# Altium schematic sheet Analog_Inputs_10V.SchDoc
size A4; SheetNumber: 6; SheetTotal: 13
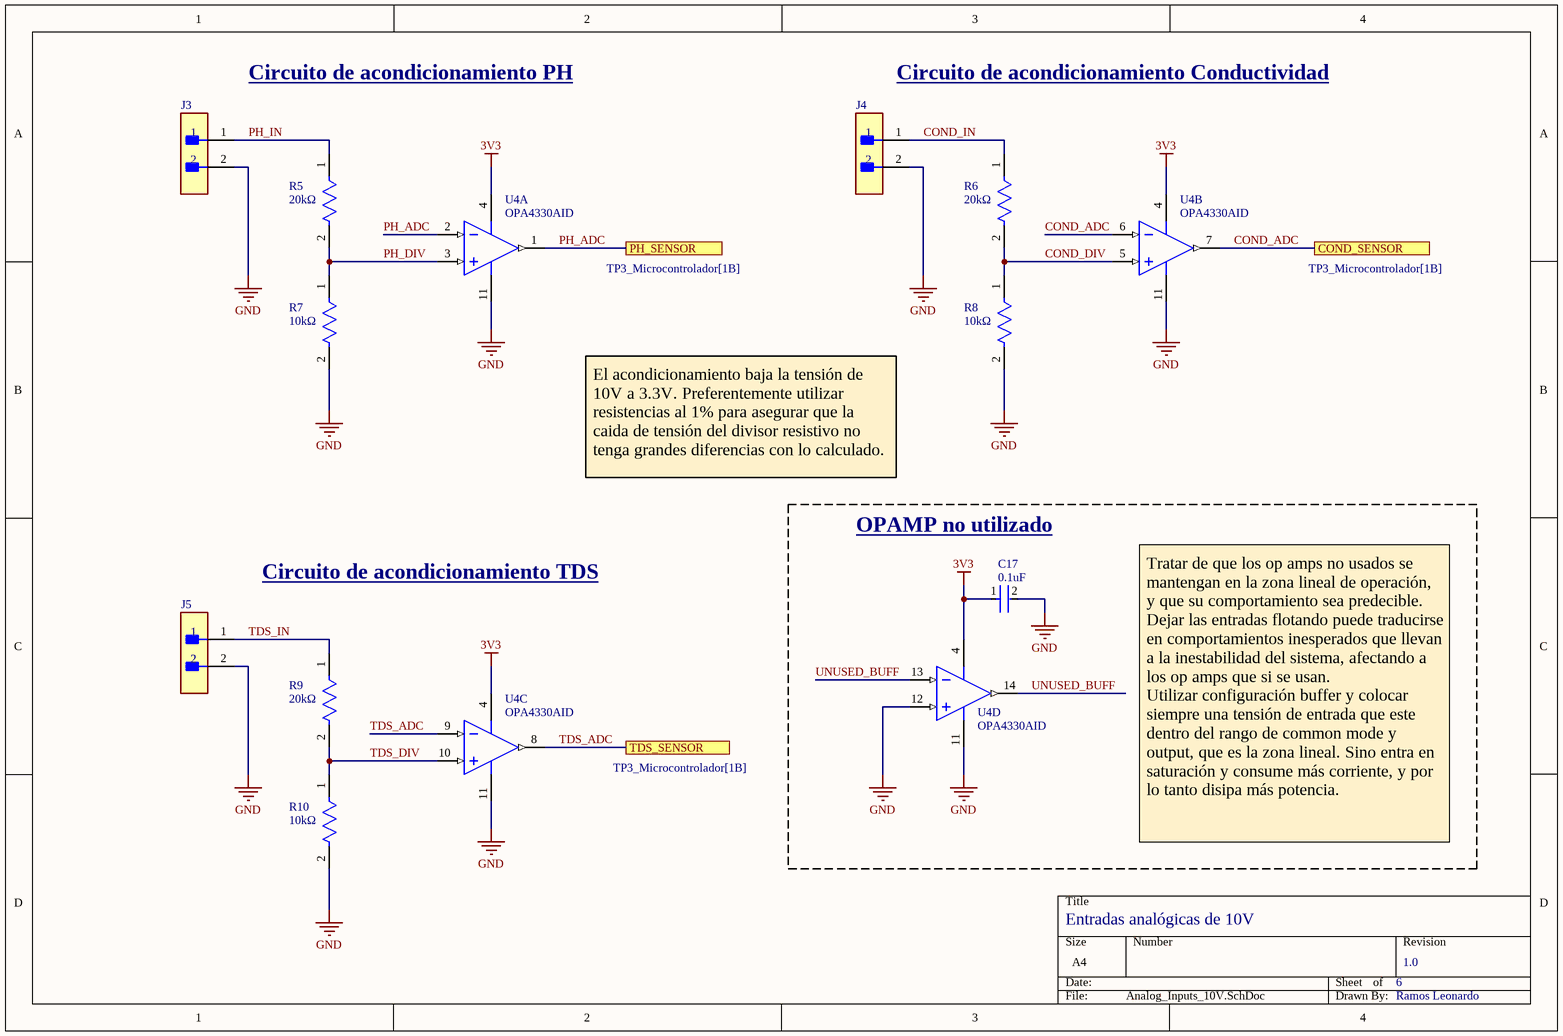
[diagram p0: Analog_Inputs_10V.SchDoc]

## Parts
C17  value 0.1uF  [FP-CC0805-0_85-MFG]  (hidden comment: CC0805KRX7R8BB104)
J3  26-60-4020  [FP-26-60-4020-MFG]  (value not drawn)
J4  26-60-4020  [FP-26-60-4020-MFG]  (value not drawn)
J5  26-60-4020  [FP-26-60-4020-MFG]  (value not drawn)
R5  Resistance: 20kΩ  [FP-CRCW0805-e3-IPC_B]  (hidden comment: CRCW08054K70JNEA)
R6  Resistance: 20kΩ  [FP-CRCW0805-e3-IPC_B]  (hidden comment: CRCW08054K70JNEA)
R7  Resistance: 10kΩ  [FP-CRCW0805-e3-IPC_B]  (hidden comment: CRCW08054K70JNEA)
R8  Resistance: 10kΩ  [FP-CRCW0805-e3-IPC_B]  (hidden comment: CRCW08054K70JNEA)
R9  Resistance: 20kΩ  [FP-CRCW0805-e3-IPC_B]  (hidden comment: CRCW08054K70JNEA)
R10  Resistance: 10kΩ  [FP-CRCW0805-e3-IPC_B]  (hidden comment: CRCW08054K70JNEA)
U4  OPA4330AID  [D0014A_N]  (parts A,B,C,D of 4)

## Blocks framed on the sheet
OPAMP no utilizado: C17 U4

## Ports
COND_SENSOR (see TP3_Microcontrolador[1B]), PH_SENSOR (see TP3_Microcontrolador[1B]), TDS_SENSOR (see TP3_Microcontrolador[1B])

## Nets
3V3: C17.1 U4.4(V+)
GND: C17.2 J3.2 J4.2 J5.2 R7.2 R8.2 R10.2 U4.11(V-) U4.12(IN_D+)
COND_ADC: U4.6(IN_B-) U4.7(OUT_B) ; port COND_SENSOR
COND_DIV: R6.2 R8.1 U4.5(IN_B+)
COND_IN: J4.1 R6.1
PH_ADC: U4.1(OUT_A) U4.2(IN_A-) ; port PH_SENSOR
PH_DIV: R5.2 R7.1 U4.3(IN_A+)
PH_IN: J3.1 R5.1
TDS_ADC: U4.8(OUT_C) U4.9(IN_C-) ; port TDS_SENSOR
TDS_DIV: R9.2 R10.1 U4.10(IN_C+)
TDS_IN: J5.1 R9.1
UNUSED_BUFF: U4.13(IN_D-) U4.14(OUT_D)

## Notes on the sheet
- Circuito de acondicionamiento PH
- Circuito de acondicionamiento Conductividad
- El acondicionamiento baja la tensión de 10V a 3.3V. Preferentemente utilizar resistencias al 1% para asegurar que la caida de tensión del divisor resistivo no tenga grandes diferencias con lo calculado.
- Circuito de acondicionamiento TDS
- Tratar de que los op amps no usados se mantengan en la zona lineal de operación, y que su comportamiento sea predecible. Dejar las entradas flotando puede traducirse en comportamientos inesperados que llevan a la inestabilidad del sistema, afectando a los op amps que si se usan.
  Utilizar configuración buffer y colocar siempre una tensión de entrada que este dentro del rango de common mode y output, que es la zona lineal. Sino entra en saturación y consume más corriente, y por lo tanto disipa más potencia.
- Entradas analógicas de 10V
- 6
- 1.0
- Ramos Leonardo

## Library data of the parts
C17 = CMP-1036-04410-2: CAP CER 0.1UF 25V X7R 0805; Manufacturer: Yageo; Tolerance: 0.1; Material: Ceramic; Capacitance: 100 nF; ComponentLink2URL: http://www.yageo.com/documents/recent/UPY-GPHC_Y5V_6.3V-to-50V_8.pdf; Category: Cap; Mouser Description: Multilayer Ceramic Capacitors MLCC - SMD/SMT 100nF 25V X7R 10%; Manufacturer Part Number: CC0805KRX7R8BB104; Device Class L1: Passive Components; Footprint Url: http://www.yageo.com/exep/pages/download/literatures/UPY-C_GEN_24.pdf; Height: 0.95mm; Digikey Description: CAP CER 0.1UF 25V X7R 0805; Lead Free: Yes; Temperature Range High: +85°C; Temperature: -30°C to +85°C; Ipc Land Pattern Name: CAPC200125X85; Automotive: No; Octopart: https://octopart.com/cc0805krx7r8bb104-yageo-39467766; Device Class L2: Capacitors; Temperature Characteristic: X7R; Voltage Rating: 25 V; ComponentLink2Description: Datasheet; Temperature Range Low: -30°C; Device Class L3: Ceramic Capacitors; RoHS: TRUE; Package: CC0805-0.85
J3-J5 = CMP-04776-000303-1: CONN HEADER VERT 2POS 3.96MM; Number of Contacts: 2; Contact Resistance: 6mR; Current Rating: 7A; Gender: Male; Voltage Rating: 250V; Number of Lines: 1; Approvals: UL; Glow Wire Compliant: Non-compliant; Depth: 10.01mm; Color: Natural; Mount: Through Hole; Flammability Rating: UL94 V-0; Max Operating Temperature: 75°C; Termination: Solder; Lead Free: Lead Free; Length: 7.77mm; Height: 14.73mm; Min Operating Temperature: 0°C; Contact Gender: Male; Housing Material: Polyester; Number of Rows: 1; Material: Polyester; Fastening Type: Friction; Contact Material: Brass; Radiation Hardening: No; Pitch: 3.96mm; Number of Circuits: 2; Contact Plating: Tin; Packaging: Bulk; Housing Color: Natural; Contact Mating Length: 0.45inch; Contact Type: Male Pin; Number of Positions: 2; Orientation: Straight; Package Quantity: 1400; Series: KK® 41791; Max Voltage Rating (AC): 250V; RoHS Compliant: Yes; Max Current Rating: 7A; Number of Poles: 2
R5-R10 = CMP-2001-03967-2: RES Thick Film, 10kΩ, 5%, 0.125W, 200ppm/°C, 0805; Power Rating: 125mW; Voltage Rating: 150V; Radiation Hardening: No; Case Code (Imperial): 0805; Military Standard: Not; Contact Plating: Tin; Weight: 0.000194oz; Mount: Surface Mount; Termination: SMD/SMT; Packaging: Tape and Reel; Min Operating Temperature: -55°C; Width: 1.25mm; Tolerance: 5%; Height: 0.45mm; Depth: 1.25mm; Length: 2mm; Temperature Coefficient: 200ppm/°C; Case Code (Metric): 2012; Package Quantity: 5000; Max Operating Temperature: 155°C; Case/Package: 0805; Composition: Thick Film
U4 = CMP-0272-00094-3: MicroPower, Precision, Zero Drift CMOS Operational Amplifier, 1.8 to 5.5 V, -40 to 125 degC, 14-pin SOIC (D14), Green (RoHS & no Sb/Br); Manufacturer: Texas Instruments; Iq per channel(Max)(mA): 0.035; Vio (25C)(Max)(mV): 0.05; Total Supply Voltage(Min)(+5V is 5, +/-5V is 10): 1.8; IIB(Max)(pA): 300; Number of Channels: 4; Total Supply Voltage(Max)(+5V is 5, +/-5V is 10): 5.5; Slew Rate(Typ)(V/us): 0.16; Offset Drift(Typ)(uV/C): 0.02; Vn at 1kHz(Typ)(nV/rtHz): 55; Sub Family: Low Offset Voltage Amplifier (<=500uV), Low Power Amp (<=500uA), Low Supply Voltage Amplifier (<=2.7V), Precision Amplifier; CMRR(Min)(dB): 100; ComponentLink2URL: http://www.ti.com/general/docs/lit/getliterature.tsp?genericPartNumber=OPA4330&fileType=pdf; PackageReference: D0014A; ComponentLink1Description: Manufacturer URL; ComponentLink1URL: http://www.ti.com/; PartNumber: OPA4330AID; ComponentLink2Description: Datasheet; DatasheetVersion: SBOS432E; Eco-Plan: Green (RoHS & no Sb/Br); ComponentLink3URL: http://www.ti.com/lit/ml/mpds177g/mpds177g.pdf; Mounting Technology: Surface Mount; ComponentLink3Description: Package Specification; PackageVersion: 4040047-5/M, 06/2011; PackageDescription: 14-Pin Plastic Small Outline, Body 8.65 x 3.9 mm, Pitch 1.27 mm; Code_JEDEC: MS-012